# Altium schematic sheet [4] - DRIVERS.SchDoc: Remote Board
size A4; CheckedBy: Rafael Lang; CompanyName: Gear Labs; DrawnBy: Pedro Neves; Organization: Gear Labs; DocumentNumber: 001/2019; Revision: v1.0; SheetNumber: 4; SheetTotal: 6
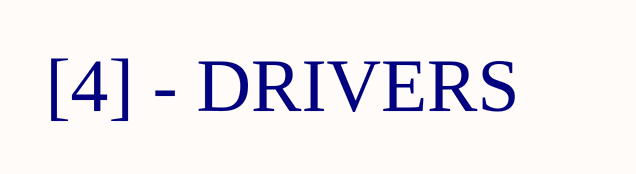
[diagram p0: [4] - DRIVERS.SchDoc]

## Notes on the sheet
- [4] - DRIVERS
- Title
- Size:
- Date:
- A4
- Number:
- Time:
- Revision:
- Sheet
- of
- Drawn by:
- Checked by:
- Variant:
- GearLabs
- File: